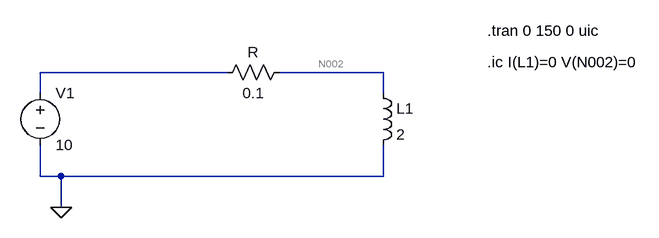
[diagram p0: schematic Inductor_Transient.asc]
Inductor_Transient.asc, the LTspice schematic file:
Version 4.1
SHEET 1 1048 680
WIRE 368 80 80 80
WIRE 608 80 448 80
WIRE 80 112 80 80
WIRE 608 112 608 80
WIRE 80 240 80 192
WIRE 112 240 80 240
WIRE 608 240 608 192
WIRE 608 240 112 240
WIRE 112 288 112 240
FLAG 112 288 0
SYMBOL voltage 80 96 R0
WINDOW 123 0 0 Left 0
WINDOW 39 0 0 Left 0
SYMATTR InstName V1
SYMATTR Value 10
SYMBOL ind 592 96 R0
SYMATTR InstName L1
SYMATTR Value 2
SYMATTR SpiceLine Rser=0 Cpar=1
SYMBOL res 352 96 R270
WINDOW 0 32 56 VTop 2
WINDOW 3 0 56 VBottom 2
SYMATTR InstName R
SYMATTR Value 0.1
TEXT 768 16 Left 2 !.tran 0 150 0 uic
TEXT 768 64 Left 2 !.ic I(L1)=0 V(N002)=0

The netlist it stands for:
* Inductor_Transient.asc
V1 N001 0 10
L1 N002 0 2 Rser=0 Cpar=1
R N001 N002 0.1
.tran 0 150 0 uic
.ic I(L1)=0 V(N002)=0
.backanno
.end